# EAGLE design potbot_v6 (EAGLE 7.6.0)
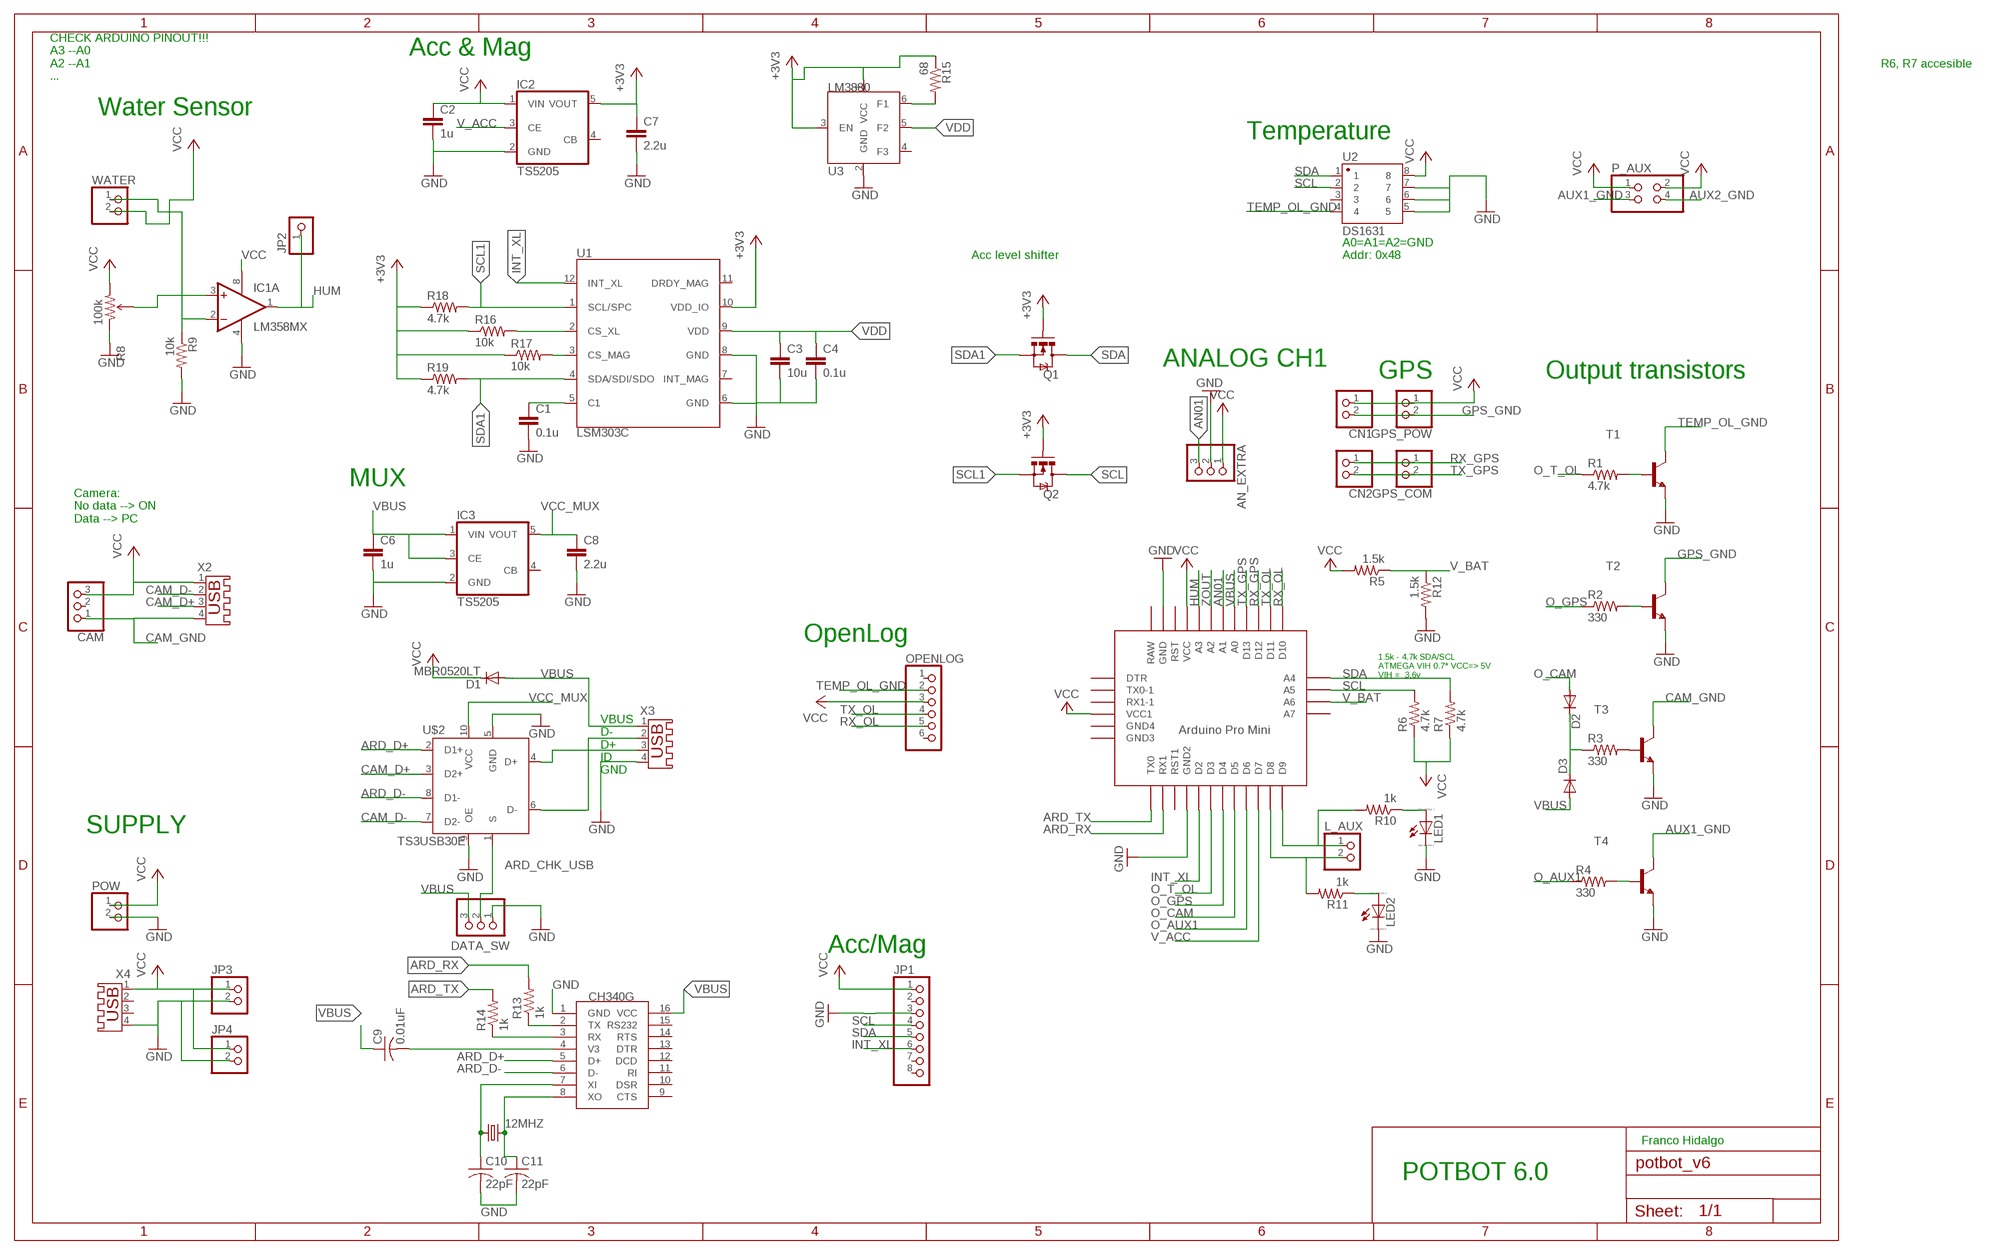
[diagram p0: schematic, sheet 1]

## Parts
12MHZ  CRYSTALSM49  [SM49]
AN_EXTRA  PINHD-1X3  [1X03]
ARDUINO  PRO-MINI-2  [PRO-MINI-2]
C1  0.1u  C-EUC1206  [C1206]
C2  1u  C-EUC1206  [C1206]
C3  10u  C-EUC1206  [C1206]
C4  0.1u  C-EUC1206  [C1206]
C6  1u  C-EUC1206  [C1206]
C7  2.2u  C-EUC1206  [C1206]
C8  2.2u  C-EUC1206  [C1206]
C9  0.01uF  C-USC1206  [C1206]
C10  22pF  C-USC1206  [C1206]
C11  22pF  C-USC1206  [C1206]
CAM  PINHD-1X3  [1X03]
CN1  JST_2PIN-THM  [JST-PH-2-THM]
CN2  JST_2PIN-THM  [JST-PH-2-THM]
D1  MBR0520LT  [SOD123]
D2  MBR0520LT  [SOD123]
D3  MBR0520LT  [SOD123]
DATA_SW  PINHD-1X3  [1X03]
GPS_COM  JST_2PIN-SMT  [JST-PH-2-SMT]
GPS_POW  JST_2PIN-SMT  [JST-PH-2-SMT]
IC1  LM358MX  [SO08]
IC2  TS5205  [SOT25]
IC3  TS5205  [SOT25]
JP1  PINHD-1X8CLEANBIG  [1X08-CLEANBIG]
JP2  PINHD-1X1  [1X01]
JP3  PINHD-1X2  [1X02]
JP4  PINHD-1X2  [1X02]
L_AUX  PINHD-1X2  [1X02]
LED1  LED_ELD260  [LED_LD260]
LED2  LED_ELD260  [LED_LD260]
OPENLOG  PINHD-1X6  [1X06]
P_AUX  PINHD-2X2  [2X02]
POW  PINHD-1X2  [1X02]
Q1  MOSFET-NCHANNELAO3404A  [SOT23-3]
Q2  MOSFET-NCHANNELAO3404A  [SOT23-3]
R1  4.7k  R-US_M1206  [M1206]
R2  330  R-US_M1206  [M1206]
R3  330  R-US_M1206  [M1206]
R4  330  R-US_M1206  [M1206]
R5  1.5k  R-US_M1206  [M1206]
R6  4.7k  R-US_M1206  [M1206]
R7  4.7k  R-US_M1206  [M1206]
R8  100k  TRIMPOTRES-09285  [TRIMPOT-3MM]
R9  10k  R-US_M1206  [M1206]
R10  1k  R-US_M1206  [M1206]
R11  1k  R-US_M1206  [M1206]
R12  1.5k  R-US_M1206  [M1206]
R13  1k  R-US_M1206  [M1206]
R14  1k  R-US_M1206  [M1206]
R15  68  R-US_M1206  [M1206]
R16  10k  R-US_M1206  [M1206]
R17  10k  R-US_M1206  [M1206]
R18  4.7k  R-US_M1206  [M1206]
R19  4.7k  R-US_M1206  [M1206]
T1  BC817-25LT1-NPN-SOT23-BEC  [SOT23-BEC]
T2  BC817-25LT1-NPN-SOT23-BEC  [SOT23-BEC]
T3  BC817-25LT1-NPN-SOT23-BEC  [SOT23-BEC]
T4  BC817-25LT1-NPN-SOT23-BEC  [SOT23-BEC]
U1  LSM303C  [LGA-12]
U2  DS1631  GENERIC-SOIC8  [SO08-UNIVERSAL]
U3  LM3880  LM3880/-QI  [SOT23-6]
U$2  TS3USB30E  [VSSOP8]
U$4  CH340G  [SOIC16]
WATER  PINHD-1X2  [1X02]
X2  USB-A003  [USB-A003]
X3  USB-A003  [USB-A003]
X4  USB-A003  [USB-A003]

## Nets
+3V3: C7.1 IC2.5(VOUT) Q1.1(G) Q2.1(G) R15.1 R16.1 R17.1 R18.1 R19.1 U1.10(VDD_IO) U3.1(VCC) U3.3(EN)
AN01: AN_EXTRA.3 ARDUINO.A1
ARD_CHK_USB: DATA_SW.2 U$2.1(S)
ARD_D+: U$2.2(D1+) U$4.5(D+)
ARD_D-: U$2.8(D1-) U$4.6(D-)
ARD_RX: ARDUINO.RX1 R13.2
ARD_TX: ARDUINO.TX0 R14.2
AUX1_GND: P_AUX.3 T4.C
AUX2_GND: P_AUX.4
CAM_D+: U$2.3(D2+) X2.3
CAM_D-: U$2.7(D2-) X2.2
CAM_GND: CAM.1 T3.C X2.4
GND: AN_EXTRA.2 ARDUINO.GND ARDUINO.GND1(GND2) C1.2 C2.2 C3.2 C4.2 C6.2 C7.2 C8.2 C10.2 C11.2 DATA_SW.1 IC1.4(P:V-) IC2.2(GND) IC3.2(GND) JP1.3 JP3.2 JP4.2 LED1.K(C) LED2.K(C) POW.2 R8.1(CCW) R9.2 R12.2 T1.E T2.E T3.E T4.E U1.6(GND) U1.8(GND) U2.5 U2.6 U2.7 U3.2(GND) U$2.5(GND) U$2.9(OE) U$4.1(GND) X3.4 X4.4
GPS_GND: CN1.2 GPS_POW.2 T2.C
HUM: ARDUINO.A3 IC1.1(A:OUT) JP2.1
INT_XL: ARDUINO.D2 JP1.6 U1.12(INT_XL)
N$1: 12MHZ.1 C10.1 U$4.7(XI)
N$2: IC1.2(A:-IN) R9.1 WATER.1
N$3: IC1.3(A:+IN) R8.2(WIPER)
N$4: R1.2 T1.B
N$5: 12MHZ.2 C11.1 U$4.8(XO)
N$6: R3.2 T3.B
N$7: R2.2 T2.B
N$8: C9.2 U$4.4(V3)
N$9: R4.2 T4.B
N$10: R13.1 U$4.2(TX)
N$11: ARDUINO.D9 L_AUX.1 R10.2
N$12: LED1.A R10.1
N$13: U$2.4(D+) X3.3
N$14: U$2.6(D-) X3.2
N$15: LED2.A R11.1
N$16: ARDUINO.D8 L_AUX.2 R11.2
N$17: D2.C D3.C R3.1
N$18: R14.1 U$4.3(RX)
N$19: C1.1 U1.5(C1)
N$20: R16.2 U1.2(CS_XL)
N$21: R15.2 U3.6(F1)
N$22: R17.2 U1.3(CS_MAG)
O_AUX1: ARDUINO.D6 R4.1
O_CAM: ARDUINO.D5 D2.A
O_GPS: ARDUINO.D4 R2.1
O_T_OL: ARDUINO.D3 R1.1
RX_GPS: ARDUINO.D12 CN2.1 GPS_COM.1
RX_OL: ARDUINO.D10 OPENLOG.5
SCL: ARDUINO.A5 JP1.4 Q2.3(D) R6.2 U2.2
SCL1: Q2.2(S) R18.2 U1.1(SCL/SPC)
SDA: ARDUINO.A4 JP1.5 Q1.3(D) R7.2 U2.1
SDA1: Q1.2(S) R19.2 U1.4(SDA/SDI/SDO)
TEMP_OL_GND: OPENLOG.2 T1.C U2.4
TX_GPS: ARDUINO.D13 CN2.2 GPS_COM.2
TX_OL: ARDUINO.D11 OPENLOG.4
V_ACC: ARDUINO.D7 IC2.3(CE)
V_BAT: ARDUINO.A6 R5.1 R12.1
VBUS: ARDUINO.A0 C6.1 C9.1 D1.A D3.A DATA_SW.3 IC3.1(VIN) IC3.3(CE) U$4.16(VCC) X3.1
VCC [supply]: AN_EXTRA.1 ARDUINO.VCC ARDUINO.VCC1 C2.1 CAM.3 CN1.1 D1.C GPS_POW.1 IC1.8(P:V+) IC2.1(VIN) JP1.1 JP3.1 JP4.1 OPENLOG.3 P_AUX.1 P_AUX.2 POW.1 R5.2 R6.1 R7.1 R8.3(CW) U2.8 WATER.2 X2.1 X4.1
VCC_MUX: C8.1 IC3.5(VOUT) U$2.10(VCC)
VDD: C3.1 C4.1 U1.9(VDD) U3.5(F2)
ZOUT: ARDUINO.A2
Unconnected: ARDUINO.A7 ARDUINO.DTR ARDUINO.GND2(GND3) ARDUINO.GND3(GND4) ARDUINO.RAW ARDUINO.RST ARDUINO.RST1 ARDUINO.RX1-1 ARDUINO.TX0-1 CAM.2 IC1.5(B:+IN) IC1.6(B:-IN) IC1.7(B:OUT) IC2.4(CB) IC3.4(CB) JP1.2 JP1.7 JP1.8 OPENLOG.1 OPENLOG.6 U1.7(INT_MAG) U1.11(DRDY_MAG) U2.3 U3.4(F3) U$4.9(CTS) U$4.10(DSR) U$4.11(RI) U$4.12(DCD) U$4.13(DTR) U$4.14(RTS) U$4.15(RS232) X4.2 X4.3

## Notes on the sheet
- Acc & Mag
- R6, R7 accesible
- CHECK ARDUINO PINOUT!!!
  A3 --A0
  A2 --A1
  ...
- Water Sensor
- Temperature
- Acc level shifter
- A0=A1=A2=GND
  Addr: 0x48
- ANALOG CH1
- GPS | Output transistors
- MUX
- Camera:
  No data --> ON
  Data --> PC
- OpenLog
- 1.5k - 4.7k SDA/SCL 
  ATMEGA VIH 0.7* VCC=> 5V
  VIH =  3.6v
- VBUS
  D-
  D+
  ID
  GND
- SUPPLY
- Acc/Mag
- Franco Hidalgo
- POTBOT 6.0

## Library data of the parts
12MHZ = crystal:CRYSTAL: CRYSTAL; OC_FARNELL: unknown; OC_NEWARK: unknown
AN_EXTRA = adafruit:PINHD-1X3: PIN HEADER
ARDUINO = Arduino-clone:PRO-MINI-2: Arduino Pro Mini Layout 2 Sparkfun.com
C1-C4 C6-C8 = rcl:C-EU: CAPACITOR, European symbol
C9-C11 = adafruit:C-US: CAPACITOR, American symbol
CAM DATA_SW = pinhead:PINHD-1X3: PIN HEADER
CN1 CN2 GPS_COM GPS_POW = adafruit:JST_2PIN: JST 2-Pin Connectors of various flavors SMT-RA (S2B-PH-SM4) 4UConnector #17311 SMT (B2B-PH-SM4) THM-RA (S2B-PH) THM (B2B-PH)
D1-D3 = diode:MBR0520LT: SCHOTTKY BARRIER RECTIFIER Source: http://onsemi.com .. MBR0520LT1-D.pdf
IC1 = linear:LM358: OP AMP also LM158; LM258; LM2904 Source: http://cache.national.com/ds/LM/LM158.pdf
IC2 IC3 = v-reg:TS5205: 150mA Low Noise LDO Voltage Regulator with Enable TSC [Taiwan Semiconductor Company, Ltd] Source: http://www.taiwansemi.com .. 5205_0409c.pdf
JP1 = adafruit:PINHD-1X8: PIN HEADER
JP2 = adafruit:PINHD-1X1: Pin header 1x1 for 0.1" spacing With round pins
JP3 JP4 L_AUX POW WATER = pinhead:PINHD-1X2: PIN HEADER
LED1 LED2 = eagle-ltspice:LED_E: LED Source: http://www.osram.convergy.de Source: www.luxeon.com Source: www.kingbright.com; SPICEMODEL: NONE; SPICEPREFIX: D; SPICETYPE: diode
OPENLOG = pinhead:PINHD-1X6: PIN HEADER
P_AUX = pinhead:PINHD-2X2: PIN HEADER
Q1 Q2 = SparkFun-DiscreteSemi:MOSFET-NCHANNEL: Common NMOSFET Parts MFG P/N Store ID Prod ID FDD8780 TRANS-09984 SI7820DN TRANS-11055 FDS6630A IC-08089 2N7002PW TRANS-11151 FQP30N06L COM-10213 TRANS-10060 BSS123LT1G TRANS-08345 BSS138 TRANS-00830 BS170 2N7000; PROD_ID: TRAN-12988
R1-R7 R9-R19 = rcl:R-US_: RESISTOR, American symbol
R8 = SparkFun-Electromechanical:TRIMPOT: Various small potentiometers for "set-and-forget" applications; PROD_ID: RES-09285; VALUE: 10k
T1-T4 = transistor:*-NPN-: NPN Transistror BF959 corrected 2008.03.06
U1 = SparkFun-DigitalIC:LSM303C: Ultra-compact high-performance eCompass module: 3D accelerometer and 3D magnetometer http://www.st.com/st-web-ui/static/active/en/resource/technical/document/datasheet/DM00089896.pdf
U2 = SparkFun-AnalogIC:GENERIC-SOIC8: A placeholder for generic narrow & wide SOIC8 foorptints - used on the DIP adapter board.
U3 = SparkFun-DigitalIC:LM3880/-QI: Simple Power Sequencer Precision enable pin & 3 open-drain output flags Input Voltage Range of 2.7 V to 5.5 V Power-Up and Power-Down Control LM3880MF-1XY (Timing Designator) AF 16ms AE 2ms AA 10ms AB 30ms AC 60ms AD 120ms The timing sequence of the LM3880 is controlled entirely by the enable (EN) pin. Upon power up, all the flags are held low until this precision enable is pulled high; PROD_ID: PROTOTYPE
U$2 = my_lib:TS3USB30E
U$4 = ch340:CH340G
X2-X4 = con-yamaichi:USB-A003: USB connector; OC_FARNELL: unknown; OC_NEWARK: unknown

## Net classes
1 supply: width 0.127 mm, clearance 0.203 mm

## Board
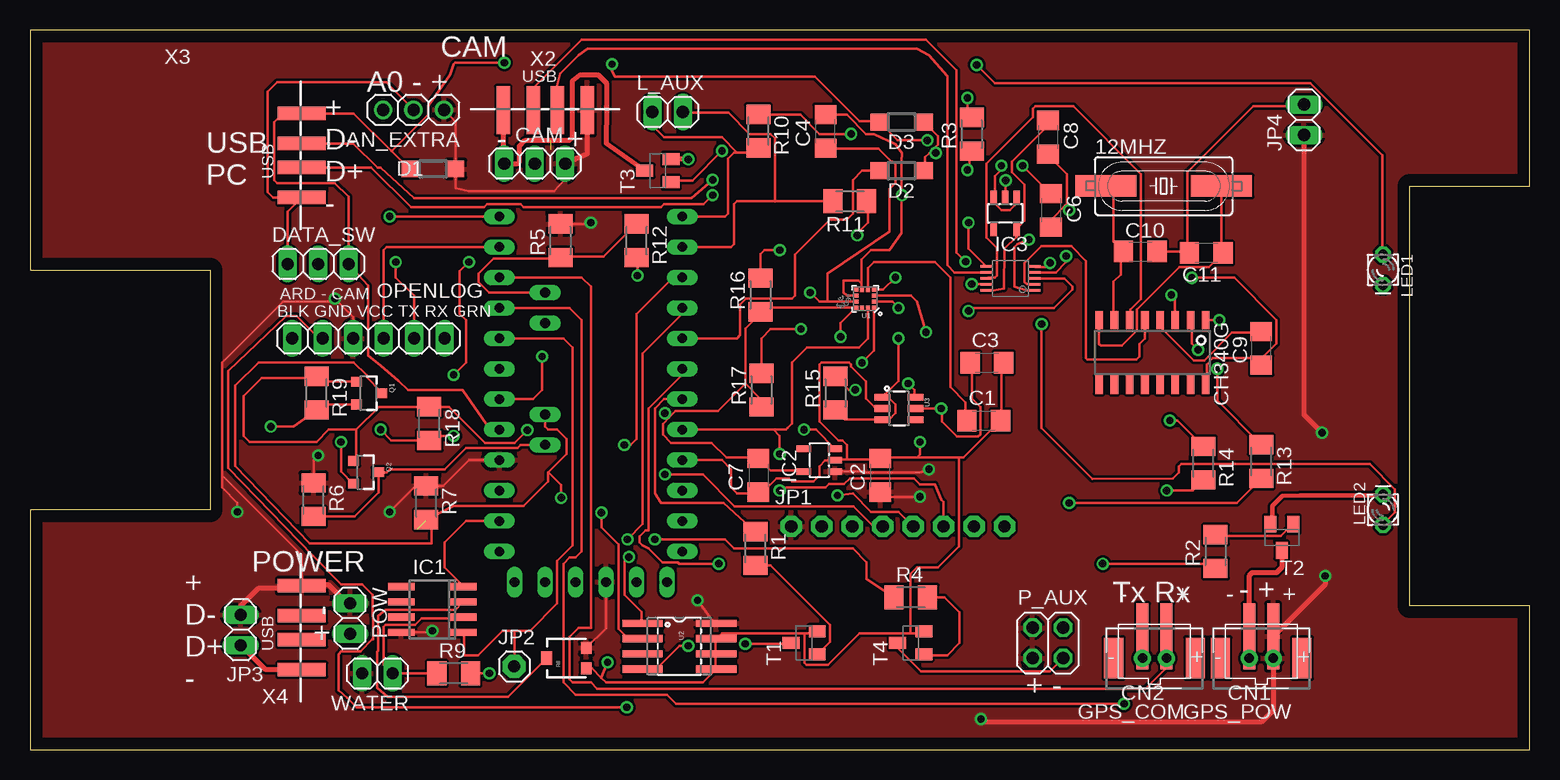
[diagram p1: board, top side]
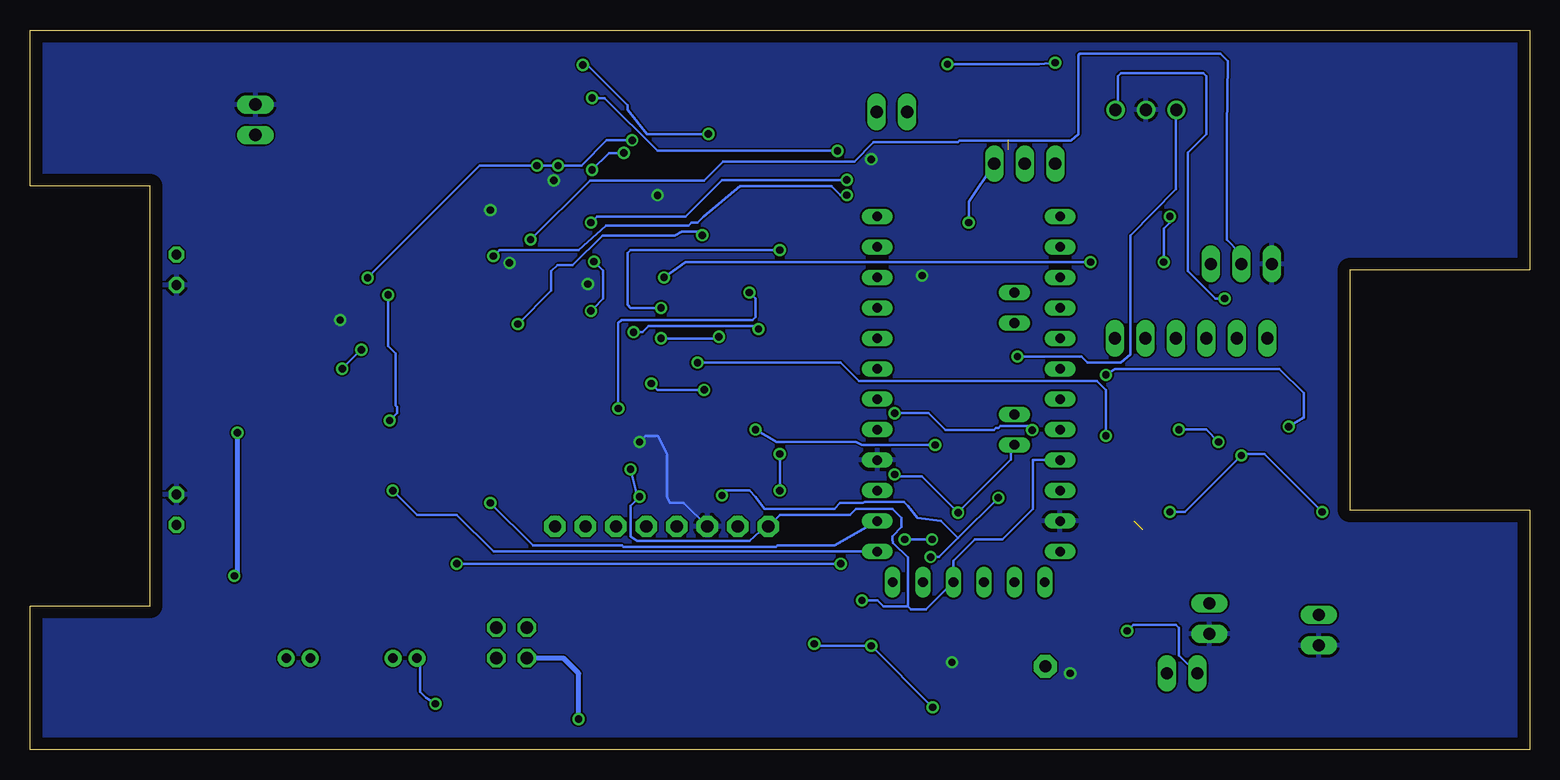
[diagram p2: board, bottom side, seen from below]

Size 125 x 60 mm. Coordinates in mm from the lower left corner, seen from the top.
Outline: 0,0 125,0 125,12 115,12 115,47 125,47 125,60 0,60 0,40 15,40 15,20 0,20 0,0
Copper layers (1*16): Top 0.035mm / dielectric 1.5mm / Bottom 0.035mm
Design rules "default *": minimum track width 0.14960625mm, minimum drill 24mil, track to track 6mil, track to pad 6mil, pad to pad 6mil, via to via 6mil, smd to smd 4mil, copper to edge 40mil, drill to drill 8mil, minimum pad ring 10mil, minimum via ring 8mil, stop-mask expansion 0mil, vias tented up to drill 0mil, thermal gap 10mil

### Footprints (pad centres in the part's own frame; a part is rotated, then mirrored left to right if it is on the bottom)
SM49 = smd 5.08 x 1.778: 1 -4.826,0; 2 4.826,0
1X03 = drill 1.016: 1 -2.54,0; 2 0,0; 3 2.54,0
PRO-MINI-2 = drill 0.8 long: A0 6.35,2.54; A1 6.35,0; A2 6.35,-2.54; A3 6.35,-5.08; A4 2.54,1.27; A5 2.54,3.81; A6 2.54,-8.89; A7 2.54,-6.35; D2 -8.89,2.54; D3 -8.89,0; D4 -8.89,-2.54; D5 -8.89,-5.08; D6 -8.89,-7.62; D7 -8.89,-10.16; D8 -8.89,-12.7; D9 -8.89,-15.24; D10 6.35,-15.24; D11 6.35,-12.7; D12 6.35,-10.16; D13 6.35,-7.62; DTR 5.08,15.24; GND 6.35,10.16; GND1 -8.89,5.08; GND2 -7.62,15.24; GND3 -5.08,15.24; RAW 6.35,12.7; RST 6.35,7.62; RST1 -8.89,7.62; RX1 -8.89,10.16; RX1-1 0,15.24; TX0 -8.89,12.7; TX0-1 2.54,15.24; VCC 6.35,5.08; VCC1 -2.54,15.24
C1206 = smd 1.6 x 1.8: 1 -1.4,0; 2 1.4,0
1X03' = drill 1.016 long: 1 -2.54,0; 2 0,0; 3 2.54,0
JST-PH-2-THM = drill 0.8 pad 1.422: 1 1,0; 2 -1,0
SOD123 = smd 1.4 x 1.4: A 1.9,0; C -1.9,0
JST-PH-2-SMT = smd 1 x 5.5: 1 -1,-1.8; 2 1,-1.8 | smd 1.6 x 3.4: NC1 -3.4,0; NC2 3.4,0
SO08 = smd 0.6 x 2.2: 1 -1.905,-2.6; 2 -0.635,-2.6; 3 0.635,-2.6; 4 1.905,-2.6; 5 1.905,2.6; 6 0.635,2.6; 7 -0.635,2.6; 8 -1.905,2.6
SOT25 = smd 0.55 x 1.2: 1 -0.95,-1.3; 2 0,-1.3; 3 0.95,-1.3; 4 0.95,1.3; 5 -0.95,1.3
1X08-CLEANBIG = drill 1.016 pad 1.778 octagon: 1 -8.89,0; 2 -6.35,0; 3 -3.81,0; 4 -1.27,0; 5 1.27,0; 6 3.81,0; 7 6.35,0; 8 8.89,0
1X01 = drill 1.016 pad 1.93 octagon: 1 0,0
1X02 = drill 1.016 long: 1 -1.27,0; 2 1.27,0
LED_LD260 = drill 0.813 octagon: A -1.27,0; K 1.27,0
1X06 = drill 1.016 long: 1 -6.35,0; 2 -3.81,0; 3 -1.27,0; 4 1.27,0; 5 3.81,0; 6 6.35,0
2X02 = drill 1.016 octagon: 1 -1.27,-1.27; 2 -1.27,1.27; 3 1.27,-1.27; 4 1.27,1.27
SOT23-3 = smd 0.8 x 0.9: 1 -0.95,-1; 2 0.95,-1; 3 0,1.1
M1206 = smd 1.6 x 2: 1 -1.4,0; 2 1.4,0
TRIMPOT-3MM = smd 1 x 0.9: 1 -0.85,-1.65; 3 0.85,-1.65 | smd 1.1 x 0.9: 2 0,1.65
SOT23-BEC = smd 1 x 1.4: B -0.95,-1.1; C 0,1.1; E 0.95,-1.1
LGA-12 = smd 0.375 x 0.35: 1 -0.75,0.75; 2 -0.75,0.25; 3 -0.75,-0.25; 4 -0.75,-0.75; 7 0.75,-0.75; 8 0.75,-0.25; 9 0.75,0.25; 10 0.75,0.75 | smd 0.35 x 0.375: 5 -0.25,-0.75; 6 0.25,-0.75; 11 0.25,0.75; 12 -0.25,0.75
SO08-UNIVERSAL = smd 0.61 x 3.353: 1 -1.905,-3.073; 2 -0.635,-3.073; 3 0.635,-3.073; 4 1.905,-3.073; 5 1.905,3.073; 6 0.635,3.073; 7 -0.635,3.073; 8 -1.905,3.073
SOT23-6 = smd 0.55 x 1.35: 1 -0.95,-1.375; 2 0,-1.375; 3 0.95,-1.375; 4 0.95,1.375; 5 0,1.375; 6 -0.95,1.375
VSSOP8 = smd 0.22 x 1: 1 -1,-2; 2 -0.5,-2; 3 0,-2; 4 0.5,-2; 5 1,-2; 6 1,2; 7 0.5,2; 8 0,2; 9 -0.5,2; 10 -1,2
SOIC16 = smd 0.635 x 1.524: 1 -4.445,-2.695; 2 -3.175,-2.695; 3 -1.905,-2.695; 4 -0.635,-2.695; 5 0.635,-2.695; 6 1.905,-2.695; 7 3.175,-2.695; 8 4.445,-2.695; 9 4.445,2.695; 10 3.175,2.695; 11 1.905,2.695; 12 0.635,2.695; 13 -0.635,2.695; 14 -1.905,2.695; 15 -3.175,2.695; 16 -4.445,2.695
USB-A003 = smd 1.12 x 4: 1 -3.5,14; 2 -1,14; 3 1,14; 4 3.5,14

### Placement (x,y rotation side)
12MHZ  94.5,46.99 0 top
AN_EXTRA  31.97,53.34 180 top
ARDUINO  45.48,29.21 180 top
C1  79.52,27.43 0 top
C2  70.88,22.86 90 top
C3  79.77,32.26 0 top
C4  66.32,51.54 90 top
C6  85.1,44.96 270 top
C7  60.72,22.86 270 top
C8  84.85,51.05 270 top
C9  102.63,33.45 90 top
C10  92.55,41.53 0 top
C11  98.06,41.4 180 top
CAM  [1X03']  42.08,48.86 0 top
CN1  102.63,7.62 0 top
CN2  93.74,7.62 0 top
D1  33.59,48.41 180 top
D2  72.66,48.26 180 top
D3  72.66,52.32 180 top
DATA_SW  [1X03']  24.03,40.49 0 top
GPS_COM  93.74,7.62 180 top
GPS_POW  102.63,7.62 180 top
IC1  33.54,11.68 90 top
IC2  65.8,24.13 90 top
IC3  81.29,44.7 180 top
JP1  72.35,18.6 0 top
JP2  40.36,6.93 0 top
JP3  17.56,9.97 270 top
JP4  106.2,52.52 90 top
L_AUX  53.15,53.16 0 top
LED1  112.79,40 270 top
LED2  112.79,20 90 top
OPENLOG  28.21,34.29 0 top
P_AUX  84.85,8.89 0 top
POW  26.68,10.92 270 top
Q1  28.21,29.72 270 top
Q2  27.95,23.11 270 top
R1  60.47,16.76 270 top
R2  98.82,16.51 90 top
R3  78.5,51.31 90 top
R4  73.42,12.7 0 top
R5  44.21,42.43 90 top
R6  23.64,20.83 270 top
R7  33.03,20.57 270 top
R8  44.72,7.62 90 top
R9  35.32,6.35 0 top
R10  60.72,51.56 270 top
R11  68.34,45.72 180 top
R12  50.56,42.43 270 top
R13  102.63,24.01 270 top
R14  97.8,23.88 270 top
R15  67.14,29.72 90 top
R16  60.88,37.91 90 top
R17  60.97,29.97 90 top
R18  33.29,27.18 270 top
R19  23.89,29.72 270 top
T1  64.53,8.89 90 top
T2  104.35,17.7 180 top
T3  52.34,48.26 90 top
T4  73.42,8.89 90 top
U1  69.61,37.59 180 top
U2  54.13,8.61 270 top
U3  72.45,28.44 270 top
U$2  81.74,39.28 90 top
U$4  93.57,33.12 180 top
WATER  28.97,6.35 180 top
X2  42.94,67.31 180 top
X3  8.65,49.53 270 top
X4  8.65,10.16 270 top

### Tracks (layer width: path | path; a pad name or v marks a point on that pad's centre or on a via)
+3V3  (via drill 0.6, 0.61)
  Top 0.203: 27.21,26.67 27.21,24.32 Q2.1 | 27.21,26.67 29.12,28.58 R18.1 33.35,28.58 34.93,28.58 37.93,25.58 40.4,25.58 v41.46,26.64 | Q1.1 24.34,30.67 R19.1 23.76,30.99 19.32,30.99 17.79,29.46 17.79,26.16 18.3,25.65 23.89,25.65 24.91,26.67 27.21,26.67 | v67.58,34.42 67.58,35.56 U1.10 61.21,36.84 R16.1 60.87,36.34 59.63,35.1 59.63,30.52 | v72.4,34.29 72.4,30.72 U3.1 71.27,29.64 72.16,28.75 72.16,28.05 71.62,27.52 71.1,27.52 U3.3 70.92,27.52 67.92,27.52 67.22,28.22 R15.1 | IC2.5 64.39,23.29 61.75,23.29 60.87,24.17 C7.1 60.69,24.34 58.04,24.34 56.81,25.58 53.46,25.58 52.75,26.28 52.75,27.17 53.28,27.7 | 59.63,30.52 60.87,29.28 60.87,28.58 R17.1 | 53.28,27.7 53.81,28.22 57.34,28.22 59.63,30.52 | 53.28,27.7 v52.93,28.05
  Bottom 0.203: v67.58,34.42 67.7,34.29 v72.4,34.29 | v41.46,26.64 41.81,26.99 44.11,26.99 44.28,26.81 44.46,26.81 44.64,26.64 48.69,26.64 50.1,28.05 v52.93,28.05
AN01  (via drill 0.6)
  Top 0.203: v42.69,32.77 42.69,29.97 41.92,29.21 ARDUINO.A1
  Bottom 0.203: AN_EXTRA.3 29.48,53.29 29.48,46.74 33.26,42.85 33.26,32.94 34.05,32.26 36.84,32.26 37.35,32.77 v42.69,32.77
ARD_CHK_USB  (via drill 0.61)
  Top 0.203: v83.27,42.51 82.31,42.16 82.05,41.91 82.05,38.61 82.06,38.61 83.09,38.28 83.62,38.28 U$2.1
  Bottom 0.203: v83.27,42.51 78.33,47.45 68.8,47.45 67.22,49.04 56.28,49.04 54.69,50.63 47.66,50.63 47.51,50.77 39.59,50.78 38.22,50.77 37.61,51.31 37.61,57.91 37.51,58.01 25.76,58.01 25.16,57.4 25.23,51.69 25.23,42.51 24.17,41.45 24.17,40.57 DATA_SW.2
ARD_D+
  Top 0.203: U$2.2 83.62,38.81 83.09,38.81 82.92,38.98 82.92,40.57 84.33,41.98 86.8,41.98 88.03,40.75 88.03,32.63 88.15,32.51 92.22,32.51 92.47,32.77 92.47,33.81 92.93,34.27 U$4.5 92.79,35.81
ARD_D-
  Top 0.203: U$2.8 79.92,39.34 80.45,39.34 80.62,39.51 80.62,41.81 79.74,42.69 79.74,48.86 83.62,52.74 83.62,53.45 83.8,53.63 86.97,53.63 92.62,47.98 92.62,37.57 91.73,36.69 91.73,35.99 U$4.6
ARD_RX  (via drill 0.6)
  Top 0.203: v86.63,20.57 100.59,20.57 R13.2
  Bottom 0.203: ARDUINO.RX1 57.93,17.02 62.68,17.02 62.8,16.89 75.5,16.89 75.63,17.02 83.07,17.02 v86.63,20.57
ARD_TX  (via drill 0.6)
  Top 0.203: R14.2 96.92,21.59 v94.76,21.59
  Bottom 0.203: ARDUINO.TX0 86.37,16.51 89.42,19.56 92.72,19.56 v94.76,21.59
AUX1_GND
  Top 0.203: T4.C 72.33,8.82 72.33,8.47 74.27,6.53 85.03,6.53 86.09,7.58 P_AUX.3
CAM_D+  (via drill 0.6)
  Top 0.203: X2.3 41.94,55.13 45.99,59.18 74.69,59.18 77.23,56.64 77.23,41.45 v77.99,40.69 | v78.25,36.58 78.5,36.83 85.36,36.83 86.88,38.35 86.88,38.61 86.21,39.28 U$2.3
  Bottom 0.203: v77.99,40.69 77.23,39.93 77.23,39.62 77.23,37.59 77.99,36.83 v78.25,36.58
CAM_D-
  Top 0.203: X2.2 43.94,55.36 44.19,56.37 45.73,57.91 46.5,58.42 73.93,58.42 74.94,57.91 76.47,56.13 76.47,40.39 77.07,39.78 U$2.7
CAM_GND  (1 unrouted)
  Top 0.203: 51.16,48.33 T3.C
  Top 0.406: 51.16,48.33 48.04,50.55 48.04,53.61 48.04,55.57 47.36,56.25 45.87,56.25 45.24,55.77 45.23,51.08 44.95,50.8 44.5,50.8 43.45,50.8 41.29,50.8 40.81,50.32 40.81,49 40.67,48.86 CAM.1 39.44,48.95 X2.4
GND  (via drill 0.6, 0.61)
  Top 0.203: DATA_SW.1 21.49,44.87 X3.4 20.28,46.03 19.83,46.48 19.83,54.86 20.59,55.63 29.68,55.63 AN_EXTRA.2 | R8.1 46.84,6.77 47.62,5.99 | 47.62,5.99 48.02,5.59 56.09,5.59 U2.5 57.16,6.88 57.16,7.94 U2.6 57.16,8.12 57.16,9.17 U2.7 57.34,9.35 57.69,9.7 64.57,9.7 | ARDUINO.GND 36.34,19.05 34.56,17.27 34.56,15.17 IC1.4 | ARDUINO.GND1 57.67,24.13 58.43,23.37 58.43,21.84 58.94,21.34 60.6,21.34 C7.2 61.1,21.46 62.24,22.61 63.26,22.61 63.51,22.35 65.29,22.35 65.8,22.86 65.8,23.62 66.28,24.11 67.08,24.11 IC2.2 67.22,24.17 68.1,24.17 | 64.57,9.7 65.63,9.7 T1.E | 73.39,9.7 69.16,9.7 66.51,7.06 64.75,7.06 64.57,7.23 64.57,9.7 | 73.39,9.7 74.45,9.7 T4.E | C3.2 81.15,32.1 80.97,31.93 80.97,27.52 C1.2 80.8,27.34 77.8,24.34 77.45,24.34 | 68.1,24.17 70.74,24.17 C2.2 70.92,24.34 73.93,24.34 | 68.1,24.17 68.1,25.4 67.75,25.75 67.39,25.75 65.8,27.34 65.8,32.1 65.98,32.28 68.27,32.28 68.45,32.1 68.45,31.93 69.69,30.69 69.69,29.28 70.39,28.58 70.92,28.58 U3.2 | 73.93,24.34 77.45,24.34 | 73.39,9.7 73.39,14.64 73.92,15.17 75.68,15.17 77.45,16.93 77.45,24.34 | 69.33,38.86 69.33,40.87 70.12,41.66 71.64,41.66 72.66,43.04 72.66,46.22 | 69.33,38.86 69.33,38.46 U1.6 | 72.66,46.22 72.66,49.02 72.67,49.75 72.16,50.49 70.37,51.31 70.06,51.31 70.04,51.33 69.69,51.33 68.1,52.92 66.33,52.92 C4.2 | 86.27,45.34 86.44,45.51 86.44,47.98 84.86,49.57 C8.2 | 86.27,45.34 85.21,44.28 85.21,43.57 C6.2 | v78.5,38.81 79.74,38.81 U$2.9 | v85.03,40.57 84.68,40.22 83.8,40.22 U$2.5 | v81.33,47.45 81.33,46.04 IC3.2 | 53.46,49.22 T3.E | 103.55,18.88 T2.E | 112.73,21.17 LED2.K | v99.14,35.81 98.09,35.81 U$4.1 | JP4.2 106.2,53.63 101.97,53.63 96.5,48.16 96.5,41.45 C11.2 96.53,41.53 C10.2
  Top 0.203: v38.28,6.35 36.87,6.35 R9.2 | v50.63,39.51 50.63,40.93 R12.2 | v86.62,44.98 86.27,45.34 | 22.59,6.7 X4.4 | v72.68,46.22 72.66,46.22 | v48.14,7.27 47.62,5.99 | v74.18,25.65 74.18,24.6 73.93,24.34 | U1.8 68.09,37.84 67.83,38.1 67.83,39.12 69.08,39.12 69.33,38.86
  Top 0.381: 103.55,18.88 103.55,20.33 104.38,21.16 105.85,21.17 112.73,21.17
  Top 0.406: v54.87,49.22 53.46,49.22 | 22.59,6.7 19.59,6.7 17.65,8.64 JP3.2
  Bottom 0.203: v74.18,25.65 73.67,26.16 72.66,26.16 71.9,24.64 71.9,21.08 71.64,20.57 70.51,20.57 JP1.3
  pour Bottom: 0,0 125,0 125,60 0,60
GPS_GND
  Top 0.203: CN1.2 101.79,7.76 101.79,8.89 101.79,9.35 GPS_POW.2
  Top 0.254: 101.61,9.07 101.79,8.89
  Top 0.406: T2.C 104.35,15.18 103.9,14.73 101.87,14.73 101.61,14.48 101.61,9.07
HUM
  Top 0.203: ARDUINO.A3 44.46,34.29 45.23,33.53 45.23,17.02 43.96,15.75 43.96,12.19 41.67,9.91 40.4,9.91 | 40.4,9.91 39.38,9.91 37.35,7.87 36.17,7.87 36.17,9.7 IC1.1 | 40.4,9.91 40.4,7.06 JP2.1
INT_XL  (via drill 0.6)
  Top 0.203: U1.12 69.86,34.29 69.1,33.53 64.78,33.53 63.51,32.26 63.51,27.18 63.15,26.82 | ARDUINO.D2 61.99,26.67 | 61.99,26.67 63.01,26.67 63.15,26.82 | 63.16,26.81 63.15,26.82 | v62.5,21.59 63.06,21.84 66.31,21.84 66.61,22.15 67.86,22.15 68.34,22.61 73.67,22.61 74.18,22.1 75.45,22.1 75.96,20.83 76.16,20.63 JP1.6 | v62.5,24.64 62.5,26.16 61.99,26.67
  Bottom 0.203: v62.5,21.59 v62.5,24.64
N$1
  Top 0.203: U$4.7 90.32,35.99 90.32,39 90.95,39.62 90.95,41.32 C10.1 90.32,42.36 90.32,46.39 89.8,46.92 12MHZ.1
N$2
  Top 0.203: R9.1 33.88,6.35 30.35,6.35 WATER.1 30.17,6.35 29.46,7.06 29.46,10.23 29.64,10.41 32.11,10.41 32.64,10.94 35.99,10.94 IC1.2
N$3
  Top 0.203: R8.2 43.05,7.58 39.87,4.41 29.82,4.41 28.93,5.14 28.93,8.14 29.02,8.23 29.01,11.16 29.64,11.64 35.46,11.64 35.99,12.17 IC1.3
N$4
  Top 0.203: T1.B 65.8,8.12 66.69,9 66.69,10.41 61.75,15.35 60.51,15.35 R1.2
N$5
  Top 0.203: 89.09,35.81 U$4.8 89.12,33.83 89.26,33.69 91.03,33.69 92.27,34.93 92.27,36.69 95.79,40.22 98.26,40.22 99.32,41.28 C11.1 99.32,41.45 99.32,46.92 12MHZ.2
N$6  (via drill 0.61)
  Top 0.203: v57.69,49.92 55.22,47.45 53.46,47.45 T3.B | v78.15,54.33 78.15,52.92 78.33,52.74 R3.2
  Bottom 0.203: v57.69,49.92 72.68,49.92 77.09,54.33 v78.15,54.33
N$7
  Top 0.203: T2.B 105.14,18.7 104.26,17.82 98.97,17.82 R2.2
N$8
  Top 0.203: U$4.4 94.2,35.28 97.03,32.46 97.91,32.46 100.2,34.75 102.5,34.75 C9.2
N$9
  Top 0.203: 74.62,8.12 T4.B 74.59,7.87 76.47,7.87 77.48,8.89 77.48,11.43 76.21,12.7 R4.2
N$10  (via drill 0.61)
  Top 0.203: v97.38,33.34 96.85,33.87 96.85,35.81 U$4.2 | v98.97,31.75 98.97,29.11 102.5,25.58 R13.1
  Bottom 0.203: v98.97,31.75 v97.38,33.34
N$11
  Top 0.203: ARDUINO.D9 57.93,44.45 58.18,44.7 58.18,49.28 58.69,49.78 58.94,49.78 | 58.94,49.78 60.34,49.78 R10.2 | L_AUX.1 51.88,52.02 52.85,51.05 57.67,51.05 58.94,49.78
N$12  (via drill 0.61)
  Top 0.203: v68.45,51.33 65.8,51.33 64.22,52.92 60.87,52.92 R10.1 | v78.91,57.09 80.43,55.58 84.88,55.58 106.73,55.57 112.73,49.57 112.73,41.28 LED1.A
  Bottom 0.203: v68.45,51.33 73.57,51.33 75.2,53.34 75.2,53.73 78.56,57.09 v78.91,57.09
N$13  (via drill 0.6)
  Top 0.203: X3.3 28.45,48.53 31.76,45.21 37.86,45.21 38.11,45.47 40.91,45.47 41.16,45.21 52.59,45.21 52.85,45.47 56.15,45.47 v56.91,46.23 | v86.37,41.15 86.37,40.64 85.52,39.78 U$2.4
  Bottom 0.203: v56.91,46.23 57.42,46.23 58.18,46.99 65.8,46.99 68.85,44.45 69.36,43.94 69.86,43.94 70.12,43.69 76.98,43.69 79.26,41.66 85.87,41.66 v86.37,41.15
N$14  (via drill 0.6)
  Top 0.203: X3.2 26.95,50.53 28.97,48.51 29.22,48.51 32.02,45.97 55.13,45.97 v56.91,47.5 | v78.25,43.94 78.25,41.78 U$2.6
  Bottom 0.203: v56.91,47.5 67.32,47.5 70.37,44.45 77.74,44.45 v78.25,43.94
N$15  (via drill 0.61)
  Top 0.203: v68.97,42.89 69.1,43.18 69.86,43.94 69.86,45.69 R11.1 | v84.33,35.48 84.33,26.81 88.56,22.58 95.26,22.61 95.77,23.11 95.77,23.62 95.97,23.82 100.25,23.82 101.61,23.81 111.67,23.81 113.79,21.7 113.79,19.76 112.9,18.88 LED2.A
  Bottom 0.203: v68.97,42.89 69.26,43.18 70.63,43.18 71.27,42.87 77.09,42.87 77.29,42.87 79.77,40.39 81.04,40.39 81.55,39.88 81.55,38.26 v84.33,35.48
N$16
  Top 0.203: ARDUINO.D8 58.43,41.91 58.69,42.16 58.69,45.47 58.94,45.72 62.1,45.72 | 62.1,45.72 R11.2 | 62.1,45.72 62.1,50.98 61.75,51.33 59.98,51.33 58.22,53.1 54.51,53.1 L_AUX.2 | 62.1,45.69 62.1,45.72
N$17  (via drill 0.61)
  Top 0.203: 74.98,49.75 75.68,50.45 75.68,51.16 74.62,52.22 D3.C | 74.98,49.75 74.62,49.39 74.62,48.33 D2.C | v78.15,48.33 78.33,48.51 78.33,49.75 R3.1 | 74.98,49.75 v75.51,49.75
  Bottom 0.203: v78.15,48.33 76.74,49.75 v75.51,49.75
N$18  (via drill 0.6, 0.61)
  Top 0.203: v95.14,37.91 95.26,37.85 95.44,37.67 95.44,35.99 U$4.3 | R14.1 95.65,27.43 v95.01,27.43
  Bottom 0.203: v95.01,27.43 94.38,28.06 94.38,28.58 94.5,28.7 94.5,33.02 95.14,33.66 v95.14,37.91
N$19
  Top 0.203: U1.5 69.86,40.13 70.37,40.64 75.45,40.64 76.72,39.37 76.72,30.23 77.99,28.96 77.99,27.56 C1.1
N$20  (via drill 0.6)
  Top 0.203: R16.2 60.88,41.31 61.23,41.66 v62.5,41.66 | U1.2 71.89,37.34 v72.4,36.83
  Bottom 0.203: v62.5,41.66 74.94,41.66 75.2,41.4 75.2,37.08 74.94,36.83 v72.4,36.83
N$21  (via drill 0.61)
  Top 0.203: v73.21,30.52 73.74,29.99 73.74,29.46 U3.6 | v68.8,29.99 68.27,29.99 67.22,31.05 R15.2
  Bottom 0.203: v73.21,30.52 72.68,29.99 v68.8,29.99
N$22  (via drill 0.6)
  Top 0.203: U1.3 73.42,37.84 73.93,37.34 v74.69,34.8 | v64.28,35.05 61.74,35.05 60.97,34.29 R17.2
  Bottom 0.203: v74.69,34.8 73.93,34.8 73.42,35.31 64.53,35.31 v64.28,35.05
O_AUX1  (via drill 0.6)
  Top 0.203: ARDUINO.D6 54.37,36.32 51.07,33.02 51.07,18.8 v49.8,17.53 | v52.08,17.53 57.93,17.53 58.69,16.76 68.59,16.76 69.74,15.62 69.74,14.22 R4.1
  Bottom 0.203: v49.8,17.53 v52.08,17.53
O_CAM
  Top 0.203: ARDUINO.D5 58.94,34.29 59.2,34.54 59.2,37.08 59.7,37.59 63.51,37.59 63.77,37.85 63.77,41.27 66.69,44.2 68.09,44.2 68.59,44.7 68.59,47.5 69.36,48.26 D2.A
O_GPS  (via drill 0.6)
  Top 0.203: ARDUINO.D4 54.37,31.24 51.58,28.45 51.58,18.29 51.32,18.29 50.81,17.78 50.81,17.27 51.07,17.02 51.58,16.76 52.74,15.6 54.01,15.6 54.12,15.49 v57.42,15.49 | v89.42,15.49 98.44,15.49 R2.1
  Bottom 0.203: v57.42,15.49 v89.42,15.49
O_T_OL
  Top 0.203: ARDUINO.D3 52.85,29.21 52.08,28.45 52.08,21.34 52.59,20.57 57.8,20.57 R1.1
RX_GPS
  Top 0.203: ARDUINO.D12 45.99,39.37 46.75,38.61 46.75,10.16 45.73,10.16 44.97,9.4 44.97,5.84 45.23,5.59 46.75,5.59 47.26,5.08 92.98,5.08 94.76,6.86 94.76,7.6 CN2.1 94.73,7.76 94.73,9.35 GPS_COM.1
RX_OL  (via drill 0.6)
  Top 0.203: ARDUINO.D10 v29.99,44.45 | v30.49,40.64 30.49,39.37 32.02,37.85 OPENLOG.5
  Bottom 0.203: v29.99,44.45 29.99,43.94 30.49,43.43 v30.49,40.64
SCL  (via drill 0.61)
  Top 0.203: ARDUINO.A5 40.91,25.4 40.65,25.15 36.34,25.15 34.56,23.37 29.99,23.37 29.73,23.11 Q2.3 29.05,21.42 27.06,19.43 R6.2 | v47.63,19.76 47.63,18.52 49.05,17.11 49.05,10.05 49.75,9.35 50.99,9.35 U2.2 | v52.93,22.93 56.1,22.93 58.75,20.29 68.63,20.29 70.21,18.7 70.92,18.7 JP1.4
  Bottom 0.203: ARDUINO.A5 43.05,25.23 43.22,25.05 43.22,24.17 v47.63,19.76 50.63,22.76 52.75,22.76 v52.93,22.93
SCL1  (via drill 0.6)
  Top 0.203: v29.22,26.67 30.12,25.78 R18.2 33.67,26.16 v35.32,26.16 | v25.92,25.65 25.92,23.2 Q2.2 | U1.1 70.36,33.26 v69.36,32.26
  Bottom 0.203: v29.22,26.67 26.94,26.67 v25.92,25.65 | v69.36,32.26 57.42,32.26 55.89,30.73 36.08,30.73 35.32,29.97 v35.32,26.16
SDA  (via drill 0.6, 0.61)  (1 unrouted)
  Top 0.203: ARDUINO.A4 42.94,26.92 43.19,26.67 43.96,26.67 44.72,25.91 44.72,24.64 43.19,23.11 | 43.19,23.11 43.19,22.35 41.16,20.32 36.08,20.32 35.32,20.32 33.49,19.4 | 33.49,19.4 R7.2 32.99,19.05 | Q1.3 29.29,29.81 28.05,31.05 28.05,31.22 26.99,32.28 19.06,32.28 17.12,30.34 17.12,23.64 23.3,17.2 33.49,17.2 33.49,19.4 | v49.93,16.05 49.58,15.7 49.58,12.88 50.99,11.47 50.99,10.58 U2.1 | v44.28,20.99 44.28,22.05 43.22,23.11 43.19,23.11 | v67.32,21.18 68.59,21.34 70.12,19.81 72.41,19.81 JP1.5
  Bottom 0.203: v49.93,16.05 49.22,16.05 47.63,17.64 | v44.28,20.99 47.63,17.64 | 47.63,17.64 49.05,19.05 51.01,19.31 51.83,20.32 52.15,20.64 55.4,20.64 55.62,20.56 55.82,20.56 57.48,20.56 57.93,20.07 63.77,20.07 64.53,21.08 65.04,21.59 67.07,21.59 v67.32,21.18 | 73.57,18.7 JP1.5
SDA1  (via drill 0.6)
  Top 0.203: Q1.2 24.34,28.77 R19.2 21.99,26.92 v20.08,26.92 | v36.59,40.64 35.83,39.88 35.83,36.32 36.34,35.81 36.34,32.26 v35.32,31.24 | U1.4 71.12,38.34 v72.15,39.37
  Bottom 0.203: v72.15,39.37 70.37,40.64 v36.59,40.64 | v35.32,31.24 34.56,31.75 20.84,31.75 18.81,29.72 18.81,27.69 v20.08,26.92
TEMP_OL_GND  (via drill 0.61)
  Top 0.203: v59.63,8.82 63.33,8.82 T1.C | v54.87,8.64 54.16,8.64 52.4,6.88 51.16,6.88 U2.4 | v49.75,3.53 27.22,3.53 26.43,4.32 25.71,4.94 25.71,7.92 25.92,8.2 27.57,8.2 28.54,9.17 28.59,9.17 28.58,12.9 27.7,13.76 25.95,13.76 23.59,16.13 16.51,23.46 16.51,31.58 21.35,36.16 22.23,36.16 24,34.4 24.35,34.4 OPENLOG.2
  Bottom 0.203: v59.63,8.82 59.45,8.64 v54.87,8.64 v49.75,3.53
TX_GPS  (via drill 0.6)
  Top 0.203: ARDUINO.D13 44.97,36.83 45.99,35.81 45.99,16.51 45.48,16 44.97,16 44.46,15.49 44.46,5.59 45.48,4.57 53.1,4.57 53.86,3.81 v91.2,3.81 | GPS_COM.2 92.79,9.35 92.79,7.76 CN2.2
  Bottom 0.203: v91.2,3.81 91.96,4.32 92.47,4.83 92.47,7.35 CN2.2
TX_OL
  Top 0.203: ARDUINO.D11 29.73,41.91 29.48,41.66 OPENLOG.4
V_ACC  (via drill 0.6)
  Top 0.203: ARDUINO.D7 53.61,39.37 50.56,36.32 50.56,25.91 50.05,25.4 v49.54,25.4 | v64.53,26.67 65.51,26.67 IC2.3
  Bottom 0.203: v49.54,25.4 55.64,25.4 56.15,25.65 62.75,25.65 v64.53,26.67
V_BAT
  Top 0.203: R12.1 50.46,43.75 47.81,41.1 44.28,41.1 R5.1 44.11,40.93 38.64,40.93 37.4,39.69 37.4,38.98 38.28,38.1 42.87,38.1 ARDUINO.A6
VBUS  (via drill 0.6, 0.61)
  Top 0.203: 30.16,49.91 26.96,53.03 X3.1 22.59,53.09 21.1,53.09 20.33,52.32 20.33,47.5 20.59,47.24 25.41,47.24 26.57,46.09 DATA_SW.3 28.21,38.7 28.21,32.87 29.22,32 30.75,30.73 31.51,29.97 36.08,29.97 38.37,26.67 ARDUINO.A0 | 30.16,49.91 D1.A | 102.32,32.28 102.5,32.1 C9.1 102.32,32.28 | 102.32,32.28 101.97,32.63 98.61,32.63 98.09,32.1 98.09,30.52 U$4.16 | IC3.1 82.21,45.87 82.21,45.51 81.68,44.98 80.97,44.98 80.45,45.51 80.45,45.87 IC3.3 80.45,46.04 80.45,47.8 80.97,48.33 v80.97,48.69 | v82.74,48.69 85.03,46.39 C6.1 | 102.32,32.28 103.91,33.87 103.91,35.81 100.38,39.34 v96.85,39.34 | v39.54,57.27 35.44,57.27 35.32,57.15 35.03,56.25 33.17,53.63 33.17,52.92 30.17,49.92 30.16,49.91 | v74.8,50.8 72.33,50.8 70.92,52.22 D3.A 70.74,52.39 69.16,52.39 65.45,56.1 48.78,56.1 48.49,56.64 v48.53,57.15
  Bottom 0.203: v96.85,39.34 87.5,48.69 v82.74,48.69 v80.97,48.69 79.03,48.69 76.92,50.8 v74.8,50.8 | v39.54,57.27 40.91,57.15 41.17,57.16 41.42,57.16 41.67,57.15 v48.53,57.15
VCC  (via drill 0.6)
  Top 0.203: ARDUINO.VCC 36.59,24.13 34.43,21.97 R7.1 32.15,21.97 v29.99,19.81 | ARDUINO.VCC1 48.02,10.12 R8.3 | AN_EXTRA.1 35.49,52.36 D1.C 35.49,46.82 36.59,46.56 43.7,46.56 44.59,47.57 CAM.3 | R5.2 46.64,43.83 v46.75,43.94 | OPENLOG.3 26.94,36.07 v25.41,37.59 25.16,37.34 21.1,37.34 16.02,32.26 16.02,22.86 | 79.52,2.29 v79.26,2.54 | IC2.1 69.54,23.18 69.61,23.11 74.18,23.11 v74.94,23.37 | v74.18,21.08 71.26,21.08 C2.1 | 22.45,13.46 X4.1 | 22.71,13.72 X4.1 | X4.1 22.65,16.23 16.02,22.86 | v17.29,19.81 17.29,20.57 16.02,21.84 16.02,22.86 | R6.1 23.64,24.13 v24.02,24.51 | U2.8 57.06,10.52 v55.64,12.45 | IC1.8 33.41,9.78 v33.54,9.91
  Top 0.406: X2.1 46.44,49.66 CAM.3 | JP4.1 106.2,27.92 v107.71,26.42 | v107.96,14.48 107.96,13.75 GPS_POW.1 103.63,3.29 102.63,2.29 79.52,2.29 | JP3.1 17.56,11.96 19.06,13.46 22.45,13.46 | POW.1 26.43,12.19 24.91,13.72 22.71,13.72
  Bottom 0.203: v46.75,43.94 46.75,45.71 CAM.3 | v25.41,37.59 26.18,37.59 28.46,39.88 28.46,49.78 26.94,51.31 26.94,56.13 27.19,56.39 34.05,56.39 34.3,56.13 34.3,53.54 AN_EXTRA.1 | v74.94,23.37 74.44,21.34 v74.18,21.08 74.94,20.32 74.94,17.78 74.41,17.4 65.01,17.4 63.71,18.6 JP1.1 62.5,19.56 56.66,19.56 56.15,20.07 53.1,20.07 52.34,19.3 52.34,18.54 53.1,17.78 53.1,17.53 53.08,17.25 51.83,16 51.83,11.94 | v29.99,19.81 28.72,19.81 v24.02,24.51 23.89,24.64 22.11,24.64 v17.29,19.81 | v55.64,12.45 54.37,12.45 53.86,11.94 51.83,11.94 | 51.83,11.94 51.58,11.68 50.31,11.68 ARDUINO.VCC1 48.02,15.75 46.24,17.53 43.96,17.53 41.42,20.07 41.42,24.13 ARDUINO.VCC | v33.54,9.91 33.03,10.41 29.48,10.41 29.22,10.16 29.22,7.87 WATER.2
  Bottom 0.406: v107.71,26.42 107.71,14.73 v107.96,14.48 | v79.26,2.54 79.26,6.35 80.53,7.62 P_AUX.1
  pour Top: 0,0 125,0 125,60 0,60
VCC_MUX
  Top 0.203: U$2.10 79.92,38.28 80.27,38.28 81.19,38.44 81.22,41.76 82.21,42.75 82.21,43.4 IC3.5 82.39,43.57 82.92,44.1 82.92,47.1 81.86,48.16 81.86,49.04 84.68,51.86 84.68,52.39 C8.1
VDD  (via drill 0.6)
  Top 0.203: U1.9 66.5,37.34 | 66.5,37.34 66.06,37.34 65.8,37.34 v65.04,38.1 | U3.5 73.83,28.45 v75.96,28.45 76.03,28.4 76.03,27.34 77.27,26.11 79.03,26.11 79.21,26.28 79.21,28.58 78.5,29.28 78.5,32.1 C3.1 | 66.5,37.34 66.5,39.69 71.65,43.19 71.64,46.74 72.15,47.24 72.15,48.77 71.88,49.04 71.8,49.04 70.74,50.1 66.33,50.1 C4.1
  Bottom 0.203: v65.04,38.1 64.53,37.59 64.53,36.07 64.78,35.81 75.71,35.81 75.96,35.56 v75.96,28.45

### Text on the board
tPlace: BLK GND VCC TX RX GRN
tNames: CAM | A0 - + | - + | USB / PC | + / D- / D+ / - | ARD - CAM | POWER | Tx Rx | - + | + - | + / D- / D+ / - | + -